# Altium schematic sheet placa_madre.SchDoc
size A3
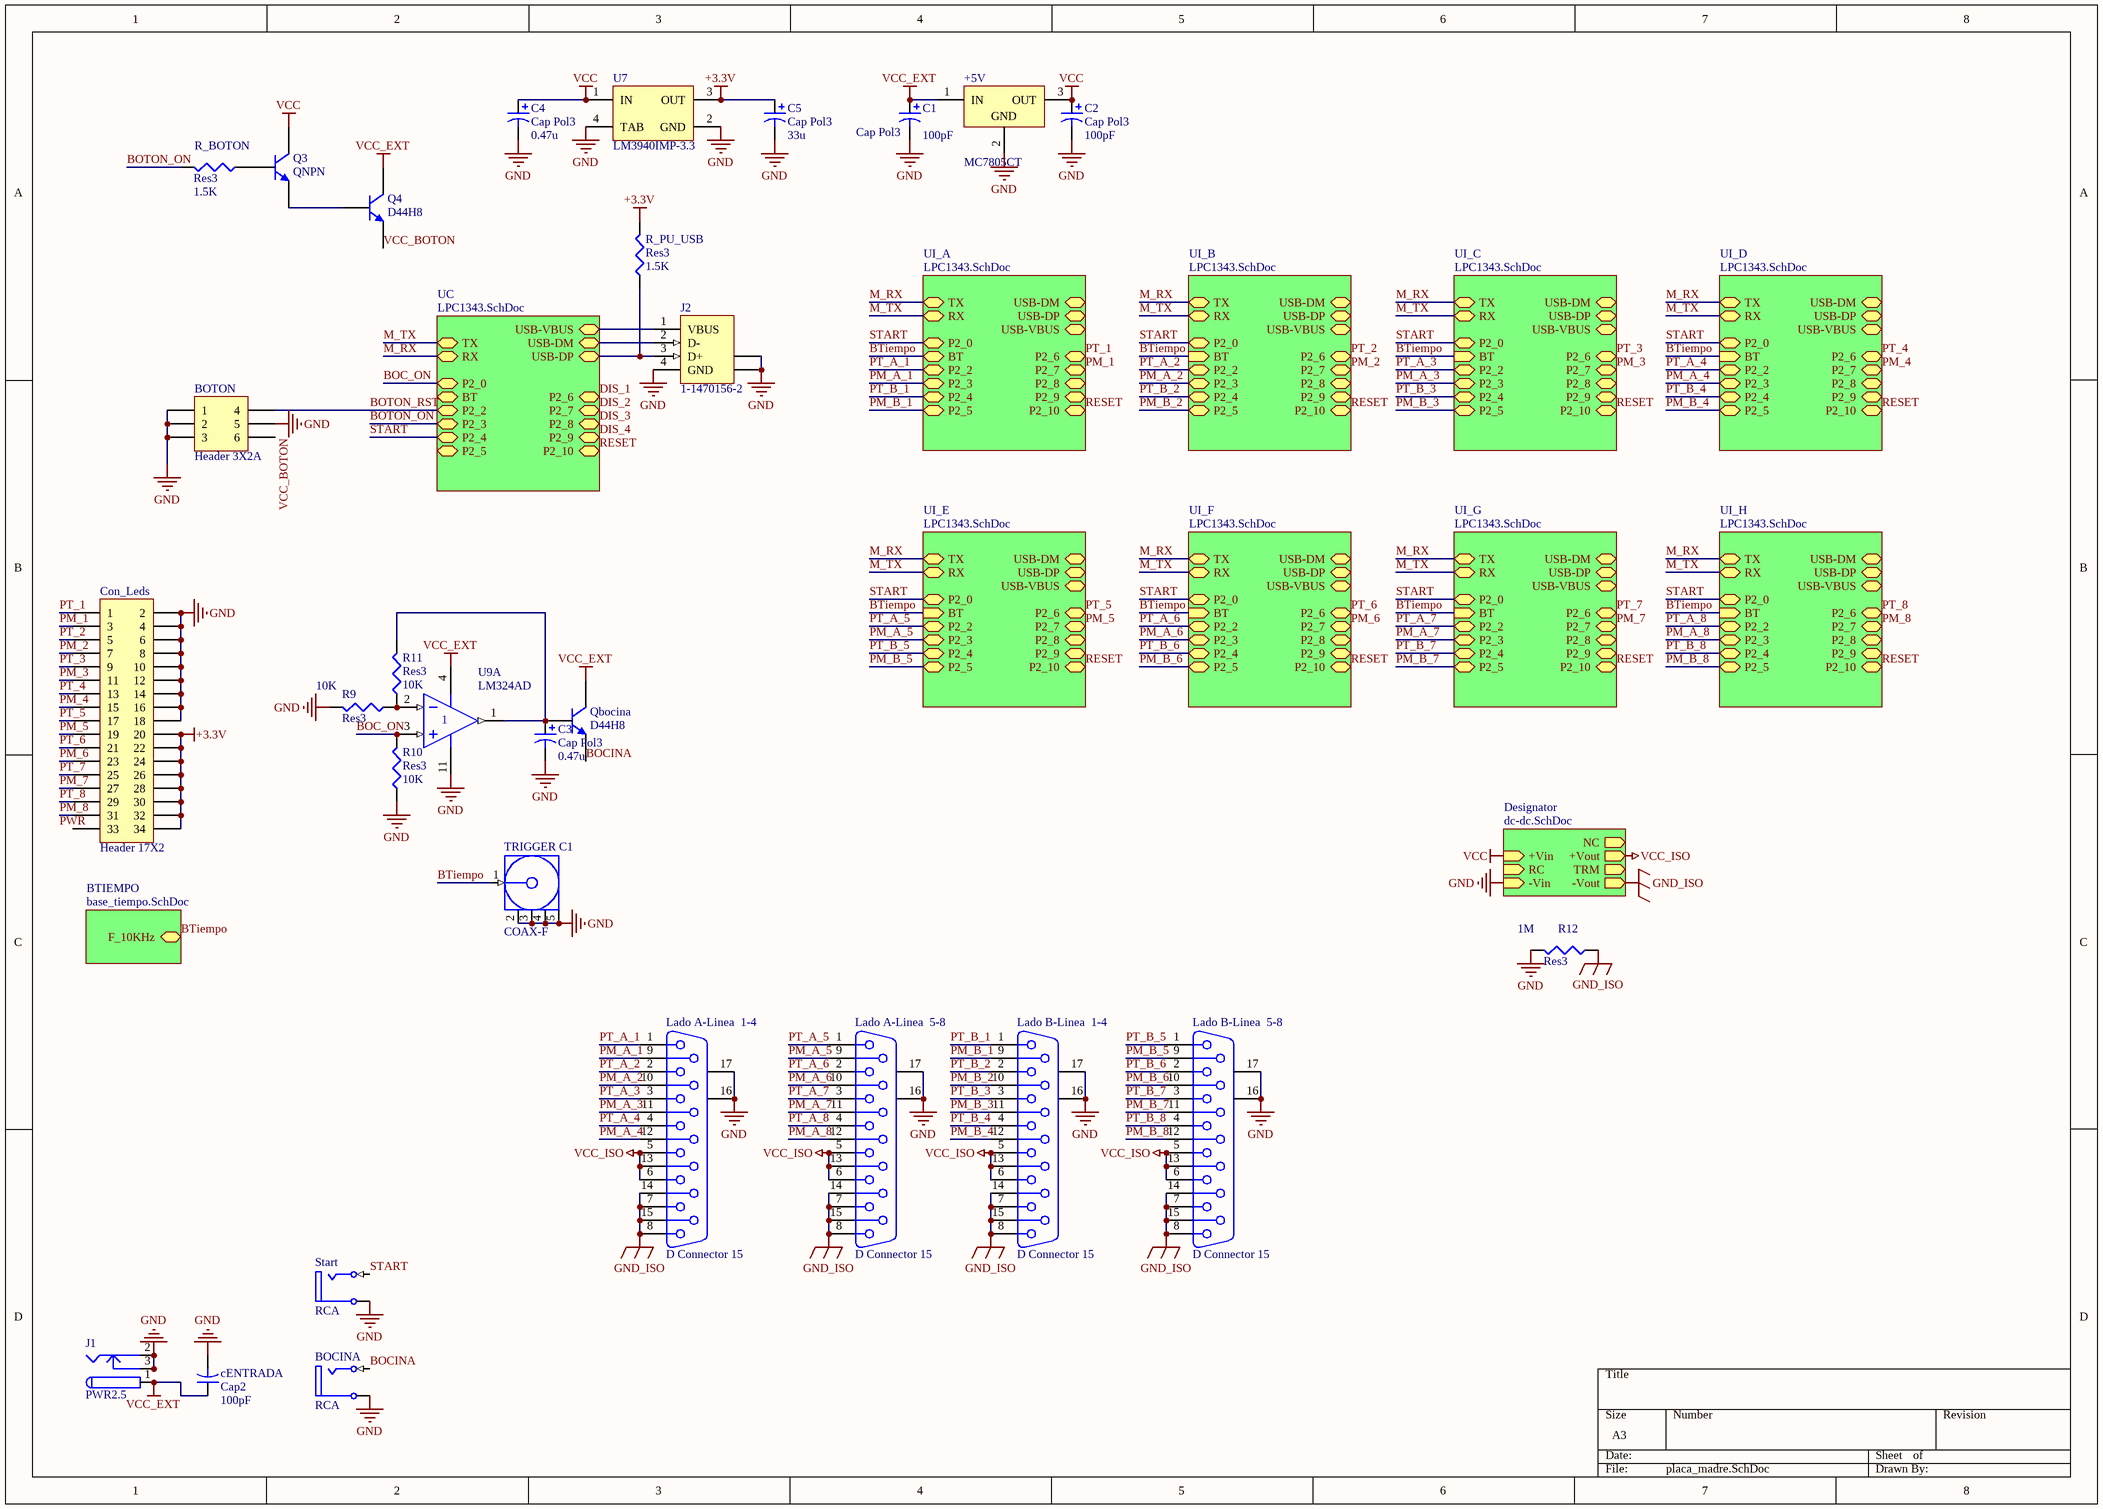
[diagram p0: placa_madre.SchDoc]

## Parts
+5V  MC7805CT  [221A-04]
BOCINA  RCA  [RCA/4.5-H2]
BOTON  Header 3X2A  [HDR2X3_CEN]
C1  Cap Pol3  value 100pF  [C0805]
C2  Cap Pol3  value 100pF  [C0805]
C3  Cap Pol3  value 0.47u  [C0805]
C4  Cap Pol3  value 0.47u  [C0805]
C5  Cap Pol3  value 33u  [C0805]
cENTRADA  Cap2  value 100pF  [CAPR5-4X5]
Con_Leds  Header 17X2  [HDR2X17]
J1  PWR2.5  [KLD-0202]
J2  1-1470156-2  [1-1470156]
Lado_A-Linea_1-4  D Connector 15  [DSUB1.385-2H15]
Lado_A-Linea_5-8  D Connector 15  [DSUB1.385-2H15]
Lado_B-Linea_1-4  D Connector 15  [DSUB1.385-2H15]
Lado_B-Linea_5-8  D Connector 15  [DSUB1.385-2H15]
Q3  QNPN  [SOT-23B]
Q4  D44H8  [TO-220]
Qbocina  D44H8  [TO-220]
R9  Res3  value 10K  [2012[0805]]
R10  Res3  value 10K  [2012[0805]]
R11  Res3  value 10K  [2012[0805]]
R12  Res3  value 1M  [2012[0805]]
R_BOTON  Res3  value 1.5K  [J1-0603]
R_PU_USB  Res3  value 1.5K  [2012[0805]]
Start  RCA  [RCA/4.5-H2]
TRIGGER_C1  COAX-F  [MCX5.08-H5]
U7  LM3940IMP-3.3  [MP04A_N]
U9  LM324AD  [751A-02_N]  (part A of 4)

## Sub-sheets
BTIEMPO = base_tiempo.SchDoc: F_10KHz (bidir)
Designator = dc-dc.SchDoc: -Vin (in), +Vin (in), +Vout (out), -Vout (out), RC (in), TRM (out), NC (out)
UC = LPC1343.SchDoc: TX (bidir), RX (bidir), P2_0 (bidir), BT (bidir), P2_2 (bidir), P2_3 (bidir), P2_4 (bidir), P2_5 (bidir), P2_6 (bidir), P2_7 (bidir), P2_8 (bidir), P2_9 (bidir), P2_10 (bidir), USB-DM (bidir), USB-DP (bidir), USB-VBUS
UI_A = LPC1343.SchDoc: TX (bidir), RX (bidir), P2_0 (bidir), BT (bidir), P2_2 (bidir), P2_3 (bidir), P2_4 (bidir), P2_5 (bidir), P2_6 (bidir), P2_7 (bidir), P2_8 (bidir), P2_9 (bidir), P2_10 (bidir), USB-DM (bidir), USB-DP (bidir), USB-VBUS (bidir)
UI_B = LPC1343.SchDoc: TX (bidir), RX (bidir), P2_0 (bidir), BT (in), P2_2 (bidir), P2_3 (bidir), P2_4 (bidir), P2_5 (bidir), P2_6 (bidir), P2_7 (bidir), P2_8 (bidir), P2_9 (bidir), P2_10 (bidir), USB-DM (bidir), USB-DP (bidir), USB-VBUS (bidir)
UI_C = LPC1343.SchDoc: TX (bidir), RX (bidir), P2_0 (bidir), BT (in), P2_2 (bidir), P2_3 (bidir), P2_4 (bidir), P2_5 (bidir), P2_6 (bidir), P2_7 (bidir), P2_8 (bidir), P2_9 (bidir), P2_10 (bidir), USB-DM (bidir), USB-DP (bidir), USB-VBUS (bidir)
UI_D = LPC1343.SchDoc: TX (bidir), RX (bidir), P2_0 (bidir), BT (in), P2_2 (bidir), P2_3 (bidir), P2_4 (bidir), P2_5 (bidir), P2_6 (bidir), P2_7 (bidir), P2_8 (bidir), P2_9 (bidir), P2_10 (bidir), USB-DM (bidir), USB-DP (bidir), USB-VBUS (bidir)
UI_E = LPC1343.SchDoc: TX (bidir), RX (bidir), P2_0 (bidir), BT (in), P2_2 (bidir), P2_3 (bidir), P2_4 (bidir), P2_5 (bidir), P2_6 (bidir), P2_7 (bidir), P2_8 (bidir), P2_9 (bidir), P2_10 (bidir), USB-DM (bidir), USB-DP (bidir), USB-VBUS (bidir)
UI_F = LPC1343.SchDoc: TX (bidir), RX (bidir), P2_0 (bidir), BT (in), P2_2 (bidir), P2_3 (bidir), P2_4 (bidir), P2_5 (bidir), P2_6 (bidir), P2_7 (bidir), P2_8 (bidir), P2_9 (bidir), P2_10 (bidir), USB-DM (bidir), USB-DP (bidir), USB-VBUS (bidir)
UI_G = LPC1343.SchDoc: TX (bidir), RX (bidir), P2_0 (bidir), BT (in), P2_2 (bidir), P2_3 (bidir), P2_4 (bidir), P2_5 (bidir), P2_6 (bidir), P2_7 (bidir), P2_8 (bidir), P2_9 (bidir), P2_10 (bidir), USB-DM (bidir), USB-DP (bidir), USB-VBUS (bidir)
UI_H = LPC1343.SchDoc: TX (bidir), RX (bidir), P2_0 (bidir), BT (in), P2_2 (bidir), P2_3 (bidir), P2_4 (bidir), P2_5 (bidir), P2_6 (bidir), P2_7 (bidir), P2_8 (bidir), P2_9 (bidir), P2_10 (bidir), USB-DM (bidir), USB-DP (bidir), USB-VBUS (bidir)

## Nets
+3.3V: C5.1 Con_Leds.20 Con_Leds.22 Con_Leds.24 Con_Leds.26 Con_Leds.28 Con_Leds.30 Con_Leds.32 Con_Leds.34 R_PU_USB.2 U7.3(OUT)
GND: +5V.2(GND) BOCINA.1A(Ground) BOTON.1 BOTON.2 BOTON.3 BOTON.5 C1.2 C2.2 C3.2 C4.2 C5.2 cENTRADA.2 Con_Leds.2 Con_Leds.4 Con_Leds.6 Con_Leds.8 Con_Leds.10 Con_Leds.12 Con_Leds.14 Con_Leds.16 Con_Leds.18 J1.2 J1.2A J1.2B J1.3 J1.3A J1.3B J2.4(GND) J2.5(SHLD) J2.6(SHLD) Lado_A-Linea_1-4.16(MH1) Lado_A-Linea_1-4.17(MH2) Lado_A-Linea_5-8.16(MH1) Lado_A-Linea_5-8.17(MH2) Lado_B-Linea_1-4.16(MH1) Lado_B-Linea_1-4.17(MH2) Lado_B-Linea_5-8.16(MH1) Lado_B-Linea_5-8.17(MH2) R9.2 R10.1 R12.2 Start.1A(Ground) TRIGGER_C1.2(GND) TRIGGER_C1.3(GND) TRIGGER_C1.4(GND) TRIGGER_C1.5(GND) U7.2(GND) U7.4(TAB) U9.11(V-) ; sheet Designator/-Vin
GND_ISO: Lado_A-Linea_1-4.7 Lado_A-Linea_1-4.8 Lado_A-Linea_1-4.14 Lado_A-Linea_1-4.15 Lado_A-Linea_5-8.7 Lado_A-Linea_5-8.8 Lado_A-Linea_5-8.14 Lado_A-Linea_5-8.15 Lado_B-Linea_1-4.7 Lado_B-Linea_1-4.8 Lado_B-Linea_1-4.14 Lado_B-Linea_1-4.15 Lado_B-Linea_5-8.7 Lado_B-Linea_5-8.8 Lado_B-Linea_5-8.14 Lado_B-Linea_5-8.15 R12.1 ; sheet Designator/-Vout
VCC: +5V.3(OUT) C2.1 C4.1 Q3.1(C) U7.1(IN) ; sheet Designator/+Vin
VCC_EXT: +5V.1(IN) C1.1 cENTRADA.1 J1.1 J1.1A J1.1B Q4.2(C) Qbocina.2(C) U9.4(V+)
VCC_ISO: Lado_A-Linea_1-4.5 Lado_A-Linea_1-4.6 Lado_A-Linea_1-4.13 Lado_A-Linea_5-8.5 Lado_A-Linea_5-8.6 Lado_A-Linea_5-8.13 Lado_B-Linea_1-4.5 Lado_B-Linea_1-4.6 Lado_B-Linea_1-4.13 Lado_B-Linea_5-8.5 Lado_B-Linea_5-8.6 Lado_B-Linea_5-8.13 ; sheet Designator/+Vout
BOC_ON: R10.2 U9.3(IN+) ; sheet UC/P2_0
BOCINA: BOCINA.2B(Signal) Qbocina.3(E)
BOTON_ON: R_BOTON.2 ; sheet UC/P2_3
BOTON_RST: BOTON.4 ; sheet UC/P2_2
BTiempo: TRIGGER_C1.1(Signal) ; sheet UI_A/BT, sheet BTIEMPO/F_10KHz, sheet UI_B/BT, sheet UI_C/BT, sheet UI_D/BT, sheet UI_H/BT, sheet UI_G/BT, sheet UI_F/BT, sheet UI_E/BT
DIS_1: sheet UC/P2_6
DIS_2: sheet UC/P2_7
DIS_3: sheet UC/P2_8
DIS_4: sheet UC/P2_9
M_RX: sheet UI_A/TX, sheet UI_B/TX, sheet UI_C/TX, sheet UI_D/TX, sheet UI_H/TX, sheet UI_G/TX, sheet UI_F/TX, sheet UI_E/TX, sheet UC/RX
M_TX: sheet UI_A/RX, sheet UI_B/RX, sheet UI_C/RX, sheet UI_D/RX, sheet UI_H/RX, sheet UI_G/RX, sheet UI_F/RX, sheet UI_E/RX, sheet UC/TX
PM_1: Con_Leds.3 ; sheet UI_A/P2_7
PM_2: Con_Leds.7 ; sheet UI_B/P2_7
PM_3: Con_Leds.11 ; sheet UI_C/P2_7
PM_4: Con_Leds.15 ; sheet UI_D/P2_7
PM_5: Con_Leds.19 ; sheet UI_E/P2_7
PM_6: Con_Leds.23 ; sheet UI_F/P2_7
PM_7: Con_Leds.27 ; sheet UI_G/P2_7
PM_8: Con_Leds.31 ; sheet UI_H/P2_7
PM_A_1: Lado_A-Linea_1-4.9 ; sheet UI_A/P2_3
PM_A_2: Lado_A-Linea_1-4.10 ; sheet UI_B/P2_3
PM_A_3: Lado_A-Linea_1-4.11 ; sheet UI_C/P2_3
PM_A_4: Lado_A-Linea_1-4.12 ; sheet UI_D/P2_3
PM_A_5: Lado_A-Linea_5-8.9 ; sheet UI_E/P2_3
PM_A_6: Lado_A-Linea_5-8.10 ; sheet UI_F/P2_3
PM_A_7: Lado_A-Linea_5-8.11 ; sheet UI_G/P2_3
PM_A_8: Lado_A-Linea_5-8.12 ; sheet UI_H/P2_3
PM_B_1: Lado_B-Linea_1-4.9 ; sheet UI_A/P2_5
PM_B_2: Lado_B-Linea_1-4.10 ; sheet UI_B/P2_5
PM_B_3: Lado_B-Linea_1-4.11 ; sheet UI_C/P2_5
PM_B_4: Lado_B-Linea_1-4.12 ; sheet UI_D/P2_5
PM_B_5: Lado_B-Linea_5-8.9 ; sheet UI_E/P2_5
PM_B_6: Lado_B-Linea_5-8.10 ; sheet UI_F/P2_5
PM_B_7: Lado_B-Linea_5-8.11 ; sheet UI_G/P2_5
PM_B_8: Lado_B-Linea_5-8.12 ; sheet UI_H/P2_5
PT_1: Con_Leds.1 ; sheet UI_A/P2_6
PT_2: Con_Leds.5 ; sheet UI_B/P2_6
PT_3: Con_Leds.9 ; sheet UI_C/P2_6
PT_4: Con_Leds.13 ; sheet UI_D/P2_6
PT_5: Con_Leds.17 ; sheet UI_E/P2_6
PT_6: Con_Leds.21 ; sheet UI_F/P2_6
PT_7: Con_Leds.25 ; sheet UI_G/P2_6
PT_8: Con_Leds.29 ; sheet UI_H/P2_6
PT_A_1: Lado_A-Linea_1-4.1 ; sheet UI_A/P2_2
PT_A_2: Lado_A-Linea_1-4.2 ; sheet UI_B/P2_2
PT_A_3: Lado_A-Linea_1-4.3 ; sheet UI_C/P2_2
PT_A_4: Lado_A-Linea_1-4.4 ; sheet UI_D/P2_2
PT_A_5: Lado_A-Linea_5-8.1 ; sheet UI_E/P2_2
PT_A_6: Lado_A-Linea_5-8.2 ; sheet UI_F/P2_2
PT_A_7: Lado_A-Linea_5-8.3 ; sheet UI_G/P2_2
PT_A_8: Lado_A-Linea_5-8.4 ; sheet UI_H/P2_2
PT_B_1: Lado_B-Linea_1-4.1 ; sheet UI_A/P2_4
PT_B_2: Lado_B-Linea_1-4.2 ; sheet UI_B/P2_4
PT_B_3: Lado_B-Linea_1-4.3 ; sheet UI_C/P2_4
PT_B_4: Lado_B-Linea_1-4.4 ; sheet UI_D/P2_4
PT_B_5: Lado_B-Linea_5-8.1 ; sheet UI_E/P2_4
PT_B_6: Lado_B-Linea_5-8.2 ; sheet UI_F/P2_4
PT_B_7: Lado_B-Linea_5-8.3 ; sheet UI_G/P2_4
PT_B_8: Lado_B-Linea_5-8.4 ; sheet UI_H/P2_4
RESET: sheet UI_A/P2_10, sheet UI_B/P2_10, sheet UI_C/P2_10, sheet UI_D/P2_10, sheet UI_H/P2_10, sheet UI_G/P2_10, sheet UI_F/P2_10, sheet UI_E/P2_10, sheet UC/P2_10
START: Start.2B(Signal) ; sheet UI_A/P2_0, sheet UI_B/P2_0, sheet UI_C/P2_0, sheet UI_D/P2_0, sheet UI_H/P2_0, sheet UI_G/P2_0, sheet UI_F/P2_0, sheet UI_E/P2_0, sheet UC/P2_4
VCC_BOTON: BOTON.6 Q4.3(E)
NetC3_1: C3.1 Qbocina.1(B) R11.2 U9.1(OUT)
NetJ2_1: J2.1(VBUS) ; sheet UC/USB-VBUS
NetJ2_2: J2.2(D-) ; sheet UC/USB-DM
NetJ2_3: J2.3(D+) R_PU_USB.1 ; sheet UC/USB-DP
NetQ3_2: Q3.2(B) R_BOTON.1
NetQ3_3: Q3.3(E) Q4.1(B)
NetR9_1: R9.1 R11.1 U9.2(IN-)

Not connected (* = marked no-connect by the designer): Con_Leds 33

## Notes on the sheet
- Labels drawn without touching a wire or pin: PWR

## Library data of the parts
+5V = MC7805CT: 3-Terminal Positive Fixed Voltage Regulator; Note: Pin 2 is electrically connected to TAB; Published: 17-Jul-2002; DatasheetVersion: 1988; PackageReference: 221A-04; Publisher: Altium Limited; PackageDescription: TO, Thru-Hole, Vertical, Heatsink Mounted; 3 In-Line Leads; Pitch 2.54 mm; Code_JEDEC: TO-262-AA; ComponentLink1Description: Manufacturer Link; ComponentLink1URL: http://www.onsemi.com/site/products/taxonomy/0,4438,503,00.html; ComponentLink2Description: Datasheet; ComponentLink2URL: http://www.onsemi.com/pub/Collateral/MC7800-D.PDF
BOCINA Start = RCA: RCA Phono Jack, Right Angle, Thru-Hole, Snap-In; PCB_Layout: Complies with manufacturer's recommendation.; DrillAndSlotSize: Corresponds to nominal value.; Published: 15-Jul-2004; LatestRevisionDate: 15-Jul-2004; LatestRevisionNote: Component Replaced.; DatasheetDocument: 7-Jul-2000; PackageDocument: 7-Jul-2000; PackageReference: 161; Publisher: Altium Limited; ComponentLink1Description: Manufacturer Link; ComponentLink1URL: http://www.mouser.com/kobiconn/
BOTON = Header 3X2A: Header, 3-Pin, Dual row; LatestRevisionDate: 17-Jul-2002; LatestRevisionNote: Re-released for DXP Platform.; Publisher: Altium Limited
C1-C5 = Cap Pol3: Polarized Capacitor (Surface Mount); Published: 8-Jun-2000; LatestRevisionDate: 29-May-2009; LatestRevisionNote: IPC-7351 Footprint Added.; PackageReference: C0805; Publisher: Altium Limited; PackageDescription: Chip Capacitor
cENTRADA = Cap2: Capacitor; Published: 23-Sep-2002; PackageReference: CAPR5-4X5; Publisher: Altium Limited
Con_Leds = Header 17X2: Header, 17-Pin, Dual row; LatestRevisionDate: 17-Jul-2002; LatestRevisionNote: Re-released for DXP Platform.; Publisher: Altium Limited
J1 = PWR2.5: Low Voltage Power Supply Connector; Published: 17-Dec-2003; DatasheetDocument: 09-May-2002; Publisher: Altium Limited; ComponentLink1Description: Manufacturer Link; ComponentLink1URL: http://domino.kycon.com/internet/Products.html
J2 = 1-1470156-2: USB 1.1, Right Angle, Thru-Hole, B Type, Receptacle, 4 Position, Black; ContactMaterial: Phosphor Bronze; ContactPlating: Gold over Nickel; TerminationLength: 3.00mm [0.118in.]; PCB_Layout: Complies with manufacturer's recommendation.; DrillSize: Corresponds to nominal value.; PanelGround: Without; Published: 15-Jul-2004; DatasheetDocument: 02-Jun-2001; PackageDocument: 02-Jun-2001; PackageReference: 1-1470156; Publisher: Altium Limited; HousingMaterial: Glass-Filled Thermoplastic; ComponentLink1Description: Manufacturer Link; ComponentLink1URL: http://www.tycoelectronics.com/; ComponentLink2Description: Packaging Specification; ComponentLink2URL: http://ecommas.tycoelectronics.com/commerce/DocumentDelivery/DDEController?Action=showdoc&DocId=Customer+Drawing%7F1470156%7FO%7Ftif%7FEnglish%7FC_1470156_O.tif
Lado_A-Linea_1-4 Lado_A-Linea_5-8 Lado_B-Linea_1-4 Lado_B-Linea_5-8 = D Connector 15: Receptacle Assembly, 15 Position, Right Angle; PackageDocument: O; Positions: 15; Published: 15-Jun-2001; LatestRevisionDate: 17-Jul-2002; LatestRevisionNote: Re-released for DXP Platform.; DatasheetDocument: 1-Sep-99; PackageReference: 788757; Publisher: Altium Limited; Orientation: Right Angle; Gender: Receptacle
Q3 = QNPN: NPN Bipolar Transistor; Published: 8-Jun-2000; LatestRevisionDate: 17-Jul-2002; LatestRevisionNote: Re-released for DXP Platform.; PackageReference: SOT-23B; Publisher: Altium Limited; Code_JEDEC: SOT-23
Q4 Qbocina = D44H8: NPN Power Amplifier; Published: 8-Jun-2000; LatestRevisionDate: 17-Jul-2002; LatestRevisionNote: Re-released for DXP Platform.; DatasheetDocument: 1997; PackageDocument: Sep-1998; PackageReference: TO-220; Publisher: Altium Limited; Code_JEDEC: TO-220-AB-alt; ComponentLink1Description: Manufacturer Link; ComponentLink1URL: http://www.fairchildsemi.com/
R9-R12 R_BOTON R_PU_USB = Res3: Resistor; Published: 8-Jun-2000; LatestRevisionDate: 29-May-2009; LatestRevisionNote: IPC-7351 Footprint Added.; PackageReference: J1-0603; Publisher: Altium Limited; PackageDescription: Chip Resistor
TRIGGER_C1 = COAX-F: RF Coaxial PCB Connector, MCX; Thru-Hole, Right-Angle Mount Socket, Blunt Post Terminal, 50 Ohm Impedance; PCB_Layout: Complies with manufacturer's recommendation.; DrillSize: Corresponds to nominal value.; Published: 15-Jul-2004; LatestRevisionDate: 15-Jul-2004; LatestRevisionNote: Component Replaced.; DatasheetDocument: 30-May-2003; PackageDocument: 04-Jul-1999; PackageReference: 919-119J-51AX; Publisher: Altium Limited; ComponentLink1Description: Manufacturer Link; ComponentLink1URL: http://www.amphenolrf.com/
U7 = LM3940IMP-3.3: 1A Low Dropout Regulator for 5V to 3.3V Conversion, 4-pin SOT-223; Manufacturer: National Semiconductor; PackageTopMarking: XYTT*L52B; PowerWise: N; CompType: LDO IC; Published: 4-Dec-2008; DatasheetVersion: Jul-2007; PackageVersion: revB, Apr-2003; PackageReference: MP04A; Publisher: Altium Limited; PackageDescription: Molded SOT-223, 6.50 x 3.56 x 1.6mm Body, 4 Lead, 2.3mm Pitch; Supplier 1: Farnell; Supplier Part Number 1: 9779280; PartNumber: LM3940IMP-3.3; RoHS: N; PinCount: 4; Code_JEDEC: TO-261-AA; Code_IPC: SOT223-4; ComponentLink1Description: LM3940 Datasheet; ComponentLink1URL: http://www.national.com/ds/LM/LM3940.pdf; ComponentLink2Description: LM3940 Web Page; ComponentLink2URL: http://www.national.com/pf/LM/LM3940.html; ComponentLink3Description: MP04A Package Page; ComponentLink3URL: http://www.national.com/packaging/folders/mp04a.html
U9 = LM324AD: Quad Low-Power Operational Amplifier; Published: 17-Jul-2002; LatestRevisionDate: 13-Apr-2006; LatestRevisionNote: IPC-7351 Footprint Added.; DatasheetVersion: 1988; PackageVersion: 1991; PackageReference: 751A-02; Publisher: Altium Limited; PackageDescription: 14-Pin Small Outline Integrated Circuit 1.27 mm Pitch; Code_IPC: SOIC127P600-14; ComponentLink1Description: Manufacturer Link; ComponentLink1URL: http://www.onsemi.com/site/products/parametrics/0,4446,251,00.html; ComponentLink2Description: Datasheet; ComponentLink2URL: http://www.onsemi.com/pub/Collateral/LM324-D.PDF